# Altium schematic sheet GPS.SchDoc
size A
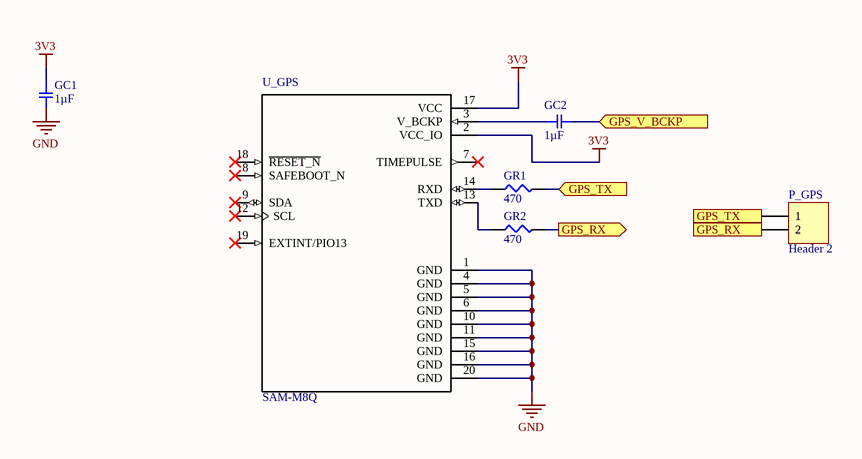
[diagram p0: GPS.SchDoc]

## Parts
GC1  1µF  [SMD-0603C]
GC2  1µF  [SMD-0603C]
GR1  470  [SMD-0603-RES]
GR2  470  [SMD-0603-RES]
P_GPS  Header 2  [HDR1X2]
U_GPS  SAM-M8Q  [*XCVR_SAM-M8Q]

## Ports
GPS_RX (out), GPS_TX (in), GPS_TX (out), GPS_V_BCKP (in)

## Nets
3V3: GC1.1 U_GPS.2(VCC_IO) U_GPS.17(VCC)
GND: GC1.2 U_GPS.1(GND) U_GPS.4(GND) U_GPS.5(GND) U_GPS.6(GND) U_GPS.10(GND) U_GPS.11(GND) U_GPS.15(GND) U_GPS.16(GND) U_GPS.20(GND)
GPS_RX: GR2.2 P_GPS.2 ; port GPS_RX
GPS_TX: GR1.2 P_GPS.1 ; port GPS_TX
GPS_V_BCKP: GC2.2 ; port GPS_V_BCKP
NetGC2_1: GC2.1 U_GPS.3(V_BCKP)
NetGR1_1: GR1.1 U_GPS.14(RXD)
NetGR2_1: GR2.1 U_GPS.13(TXD)

Not connected (* = marked no-connect by the designer): U_GPS 7(TIMEPULSE)* 8(SAFEBOOT_N)* 9(SDA)* 12(SCL)* 18(~{RESET_N})* 19(EXTINT/PIO13)*

## Library data of the parts
GC1 GC2 = GRM188R61A105KA61D: CAP CER 1UF 10V X5R 0603; Manufacturer: Murata Electronics North America; Factory Stock: 0; Unit Price (USD): 0.1; Minimum Quantity: 1; Tolerance: ±10%; Datasheets: http://www.murata.com/~/media/webrenewal/support/library/catalog/products/capacitor/mlcc/c02e.pdf; Image: //media.digikey.com/Renders/Murata%20Renders/ZRB-SERIES-0402.jpg; Digi-Key Part Number: 490-1543-1-ND; Part Number: GRM188R61A105KA61D; Quantity Available: 2638296; @ qty: 0; Packaging: Cut Tape (CT); Series: GRM; Part Status: Active; Value: 1µF; Voltage: 10V; Temperature Coefficient: X5R; Operating Temperature: -55°C ~ 85°C; Features: -; Ratings: -; Applications: General Purpose; Mounting Type: Surface Mount, MLCC; Package / Case: 0603 (1608 Metric); Size / Dimension: 0.063" L x 0.031" W (1.60mm x 0.80mm); Height - Seated (Max): -; Thickness (Max): 0.035" (0.90mm); Lead Spacing: -; Lead Style: -
GR1 GR2 = ERJ-3EKF4700V: RES SMD 470 OHM 1% 1/10W 0603; Manufacturer: Panasonic Electronic Components; Factory Stock: 0; Unit Price (USD): 0.00379; @ qty: 1500; Minimum Quantity: 1; Power (Watts): 0.1W, 1/10W; Temperature Coefficient: ±100ppm/°C; Part Number: ERJ-3EKF4700V; Datasheets: http://industrial.panasonic.com/www-cgi/jvcr13pz.cgi?E+PZ+3+AOA0002+ERJ3EKF4700V+7+WW; Image: //media.digikey.com/Photos/Panasonic%20Photos/MFG_ERJ-P6W%20Series.jpg; Digi-Key Part Number: P470HCT-ND; Quantity Available: 553629; Packaging: Cut Tape (CT); Series: ERJ; Part Status: Active; Value: 470; Tolerance: ±1%; Composition: Thick Film; Features: Automotive AEC-Q200; Operating Temperature: -55°C ~ 155°C; Package / Case: 0603 (1608 Metric); Supplier Device Package: 0603; Size / Dimension: 0.063" L x 0.031" W (1.60mm x 0.80mm); Height - Seated (Max): 0.022" (0.55mm); Number of Terminations: 2; Failure Rate: -
P_GPS = Header 2: Header, 2-Pin; LatestRevisionDate: 17-Jul-2002; LatestRevisionNote: Re-released for DXP Platform.; Publisher: Altium Limited
U_GPS = SAM-M8Q: u-Blox M8 Gnss Antenna Module; MF: U-Blox America; Digi-Key_Purchase_URL: https://www.digikey.com/product-detail/en/u-blox-america-inc/SAM-M8Q-0-10/672-1054-1-ND/7393573?utm_source=snapeda&utm_medium=aggregator&utm_campaign=symbol; Package: SMD-20 U-Blox America; MP: SAM-M8Q; SnapEDA_Link: https://www.snapeda.com/parts/SAM-M8Q/U-Blox%20America%20Inc./view-part/?ref=snap; Digi-Key_Part_Number: 672-1054-1-ND; Value: *